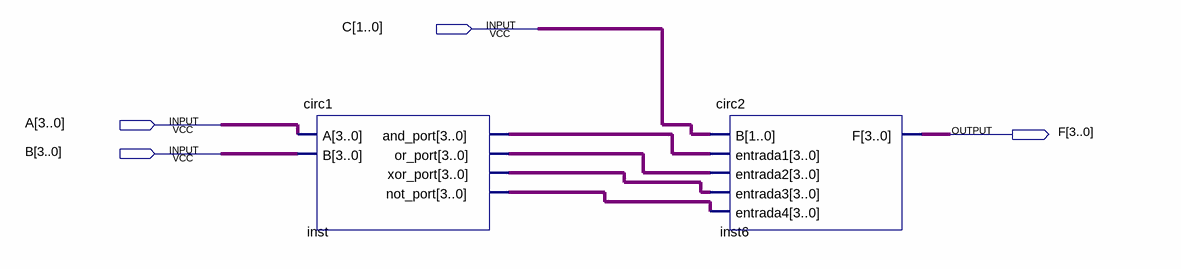
[diagram p0: schematic sheet]
// Quartus schematic ula.bdf as structural Verilog: 2 symbols, 4 pins
module ula (
  input  [1:0] C,
  input  [3:0] A,
  input  [3:0] B,
  output [3:0] F
);

  wire [3:0] inst_and_port, inst_not_port, inst_or_port, inst_xor_port;

  circ1 inst (
    .A(A), .B(B), .and_port(inst_and_port), .or_port(inst_or_port), .xor_port(inst_xor_port),
    .not_port(inst_not_port));
  circ2 inst6 (
    .B(C), .entrada1(inst_and_port), .entrada2(inst_or_port), .entrada3(inst_xor_port),
    .entrada4(inst_not_port), .F(F));
endmodule
